# EAGLE design behavior_interface (EAGLE 9.6.2)
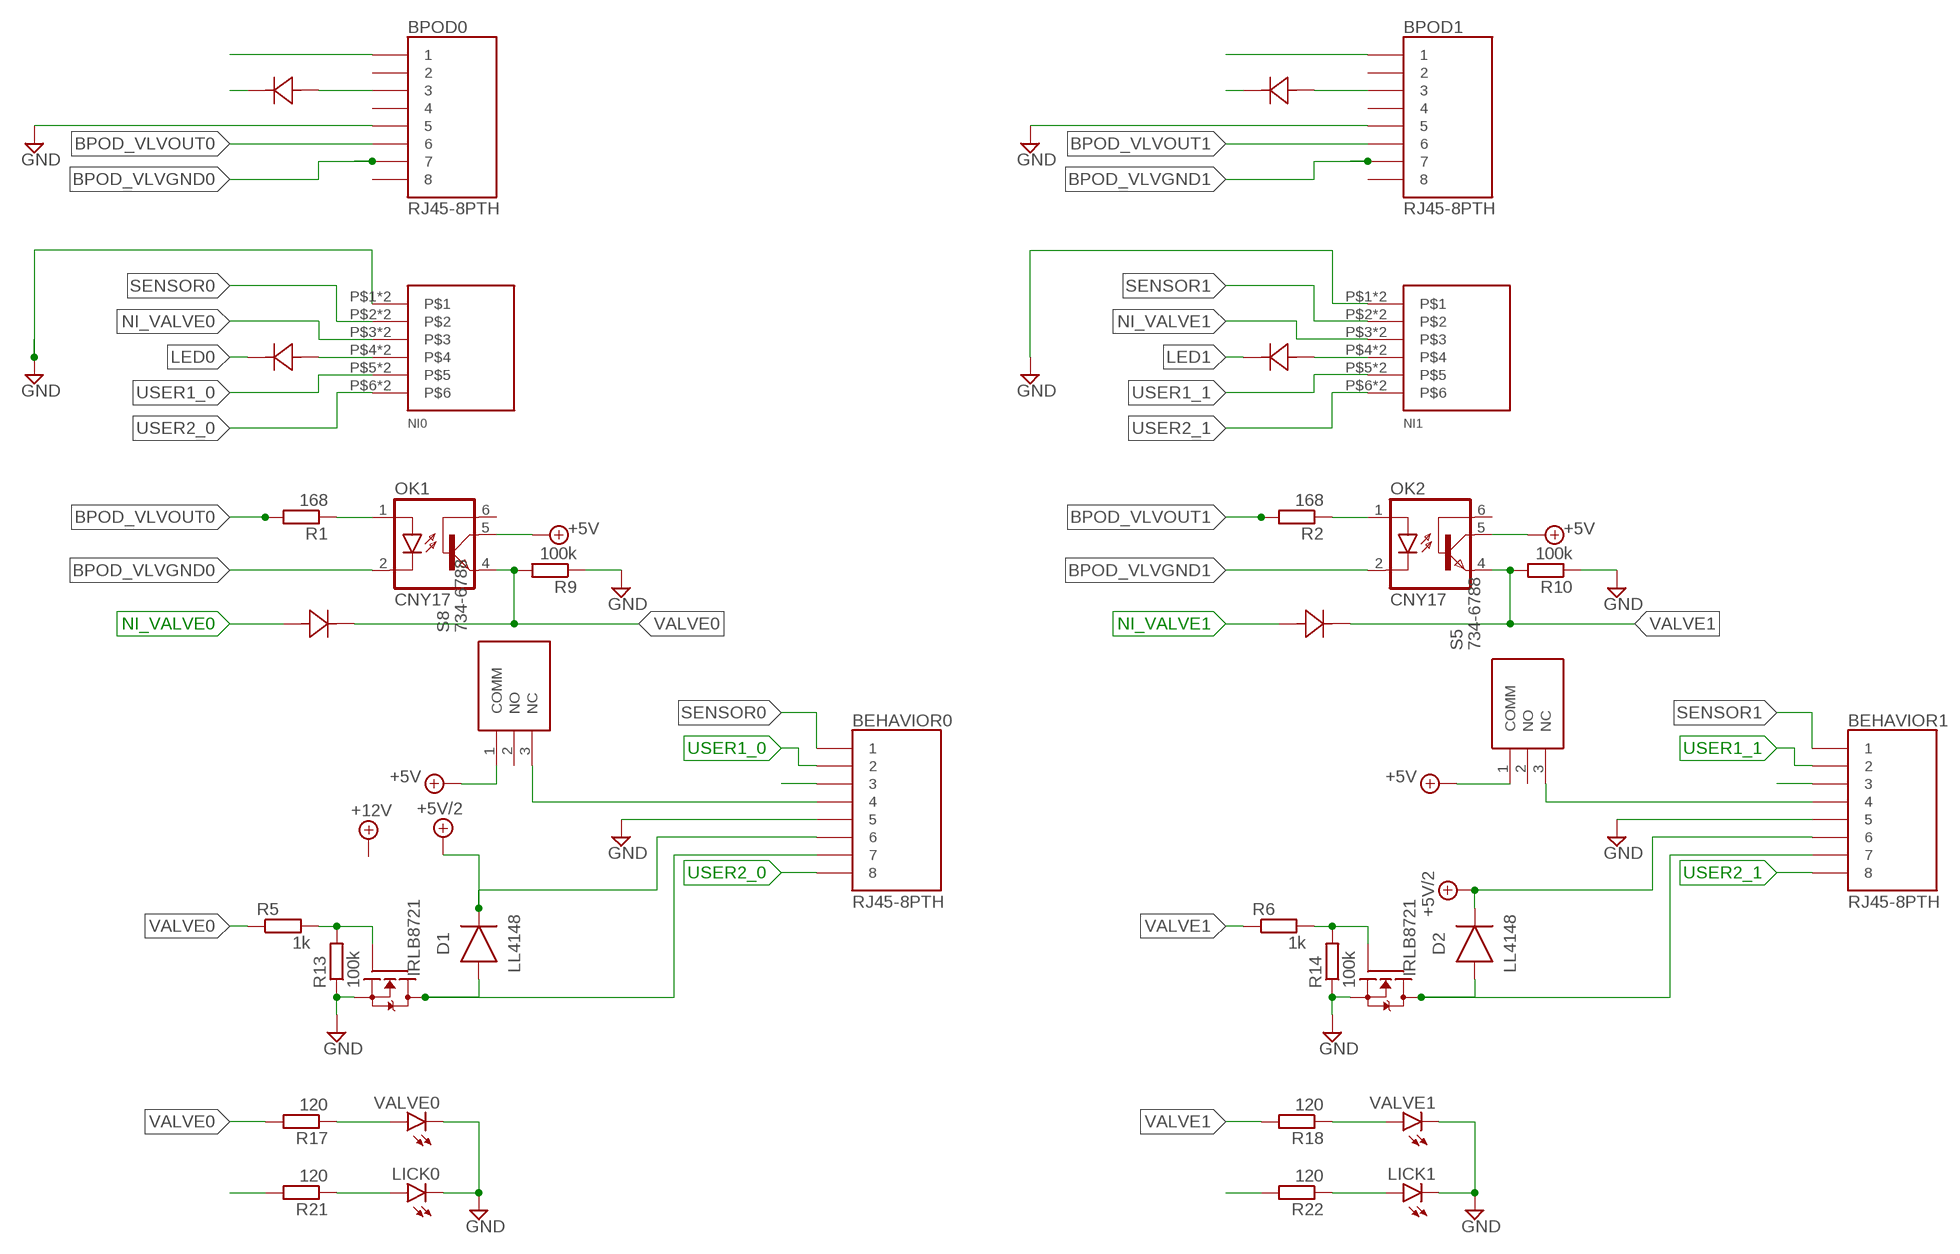
[diagram p0: schematic, sheet 1, part 1 of 2]
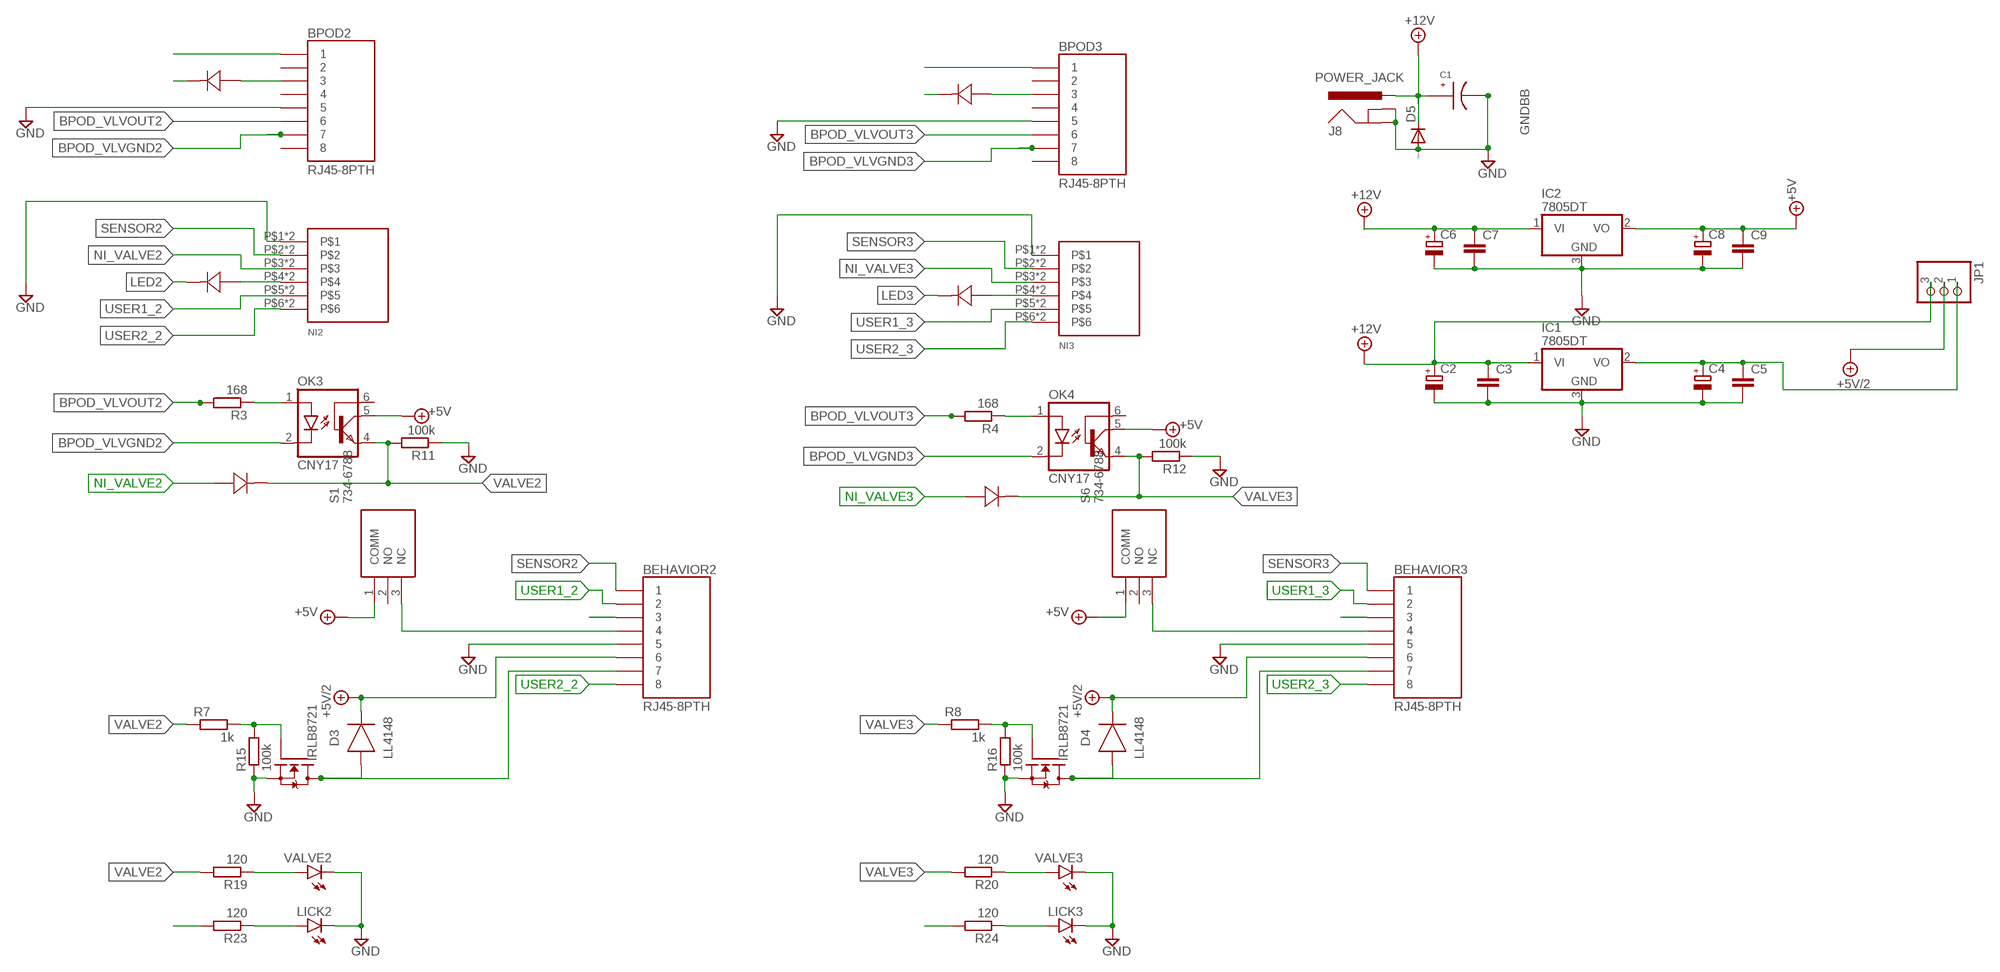
[diagram p1: schematic, sheet 1, part 2 of 2]

## Parts
BEHAVIOR0  RJ45-8PTH  [RJ45-8]
BEHAVIOR1  RJ45-8PTH  [RJ45-8]
BEHAVIOR2  RJ45-8PTH  [RJ45-8]
BEHAVIOR3  RJ45-8PTH  [RJ45-8]
BPOD0  RJ45-8PTH  [RJ45-8]
BPOD1  RJ45-8PTH  [RJ45-8]
BPOD2  RJ45-8PTH  [RJ45-8]
BPOD3  RJ45-8PTH  [RJ45-8]
C1  EEE-FK1H100UR  [EEE-FK1H100UR]
C2  CPOL-EUD  [PANASONIC_D]
C3  C-EUC1206  [C1206]
C4  CPOL-EUD  [PANASONIC_D]
C5  C-EUC1206  [C1206]
C6  CPOL-EUD  [PANASONIC_D]
C7  C-EUC1206  [C1206]
C8  CPOL-EUD  [PANASONIC_D]
C9  C-EUC1206  [C1206]
CR1  CUS10S30USC_TOS-M  [USC_TOS-M]
CR2  CUS10S30USC_TOS-M  [USC_TOS-M]
CR3  CUS10S30USC_TOS-M  [USC_TOS-M]
CR4  CUS10S30USC_TOS-M  [USC_TOS-M]
CR5  CUS10S30USC_TOS-M  [USC_TOS-M]
CR6  CUS10S30USC_TOS-M  [USC_TOS-M]
CR7  CUS10S30USC_TOS-M  [USC_TOS-M]
CR8  CUS10S30USC_TOS-M  [USC_TOS-M]
CR9  CUS10S30USC_TOS-M  [USC_TOS-M]
CR10  CUS10S30USC_TOS-M  [USC_TOS-M]
CR11  CUS10S30USC_TOS-M  [USC_TOS-M]
CR12  CUS10S30USC_TOS-M  [USC_TOS-M]
D1  LL4148  DIODE_LL4148_SOD-80  [DIOMELF3516]
D2  LL4148  DIODE_LL4148_SOD-80  [DIOMELF3516]
D3  LL4148  DIODE_LL4148_SOD-80  [DIOMELF3516]
D4  LL4148  DIODE_LL4148_SOD-80  [DIOMELF3516]
D5  DIODE-DO214AA  [DO214AA]
IC1  7805DT  [TO252]
IC2  7805DT  [TO252]
J8  POWER_JACK  [POWER_JACK_PTH]
JP1  PINHD-1X3  [1X03]
LICK0  LEDSIDELED  [OSRAM-SIDELED]
LICK1  LEDSIDELED  [OSRAM-SIDELED]
LICK2  LEDSIDELED  [OSRAM-SIDELED]
LICK3  LEDSIDELED  [OSRAM-SIDELED]
NI0  1-2834015-6  [1-2834015-6]
NI1  1-2834015-6  [1-2834015-6]
NI2  1-2834015-6  [1-2834015-6]
NI3  1-2834015-6  [1-2834015-6]
OK1  CNY17  [DIL06]
OK2  CNY17  [DIL06]
OK3  CNY17  [DIL06]
OK4  CNY17  [DIL06]
R1  168  R-EU_M1206  [M1206]
R2  168  R-EU_M1206  [M1206]
R3  168  R-EU_M1206  [M1206]
R4  168  R-EU_M1206  [M1206]
R5  1k  R-EU_M1206  [M1206]
R6  1k  R-EU_M1206  [M1206]
R7  1k  R-EU_M1206  [M1206]
R8  1k  R-EU_M1206  [M1206]
R9  100k  R-EU_M1206  [M1206]
R10  100k  R-EU_M1206  [M1206]
R11  100k  R-EU_M1206  [M1206]
R12  100k  R-EU_M1206  [M1206]
R13  100k  R-EU_M1206  [M1206]
R14  100k  R-EU_M1206  [M1206]
R15  100k  R-EU_M1206  [M1206]
R16  100k  R-EU_M1206  [M1206]
R17  120  R-EU_M1206  [M1206]
R18  120  R-EU_M1206  [M1206]
R19  120  R-EU_M1206  [M1206]
R20  120  R-EU_M1206  [M1206]
R21  120  R-EU_M1206  [M1206]
R22  120  R-EU_M1206  [M1206]
R23  120  R-EU_M1206  [M1206]
R24  120  R-EU_M1206  [M1206]
S1  734-6788  [7346788]
S5  734-6788  [7346788]
S6  734-6788  [7346788]
S8  734-6788  [7346788]
SETUP1  IRLB8721  [TO220V]
SETUP2  IRLB8721  [TO220V]
SETUP3  IRLB8721  [TO220V]
SETUP4  IRLB8721  [TO220V]
VALVE0  LEDSIDELED  [OSRAM-SIDELED]
VALVE1  LEDSIDELED  [OSRAM-SIDELED]
VALVE2  LEDSIDELED  [OSRAM-SIDELED]
VALVE3  LEDSIDELED  [OSRAM-SIDELED]

## Nets
+5V: C8.+ C9.1 IC2.2(VO) OK1.5(COL) OK2.5(COL) OK3.5(COL) OK4.5(COL) S1.1(COMM) S5.1(COMM) S6.1(COMM) S8.1(COMM)
+5V/2: BEHAVIOR0.6 BEHAVIOR1.6 BEHAVIOR2.6 BEHAVIOR3.6 D1.1(C) D2.1(C) D3.1(C) D4.1(C) JP1.2
+12V: C1.ANODE C2.+ C3.1 C6.+ C7.1 D5.C IC1.1(VI) IC2.1(VI) J8.PWR JP1.3
BPOD_VLVGND0: BPOD0.7 OK1.2(C)
BPOD_VLVGND1: BPOD1.7 OK2.2(C)
BPOD_VLVGND2: BPOD2.7 OK3.2(C)
BPOD_VLVGND3: BPOD3.7 OK4.2(C)
BPOD_VLVOUT0: BPOD0.6 R1.2
BPOD_VLVOUT1: BPOD1.6 R2.2
BPOD_VLVOUT2: BPOD2.6 R3.2
BPOD_VLVOUT3: BPOD3.6 R4.2
GND: BEHAVIOR0.5 BEHAVIOR1.5 BEHAVIOR2.5 BEHAVIOR3.5 BPOD0.5 BPOD1.5 BPOD2.5 BPOD3.5 C1.CATHODE C2.- C3.2 C4.- C5.2 C6.- C7.2 C8.- C9.2 D5.A IC1.3(GND) IC2.3(GND) J8.GND J8.GNDBREAK LICK0.C LICK1.C LICK2.C LICK3.C NI0.P$1 NI0.P$7 NI1.P$1 NI1.P$7 NI2.P$1 NI2.P$7 NI3.P$1 NI3.P$7 R9.1 R10.1 R11.1 R12.1 R13.1 R14.1 R15.1 R16.1 SETUP1.3(S) SETUP2.3(S) SETUP3.3(S) SETUP4.3(S) VALVE0.C VALVE1.C VALVE2.C VALVE3.C
LED0: BEHAVIOR0.3 CR1.1(CATHODE) CR5.1(CATHODE)
LED1: BEHAVIOR1.3 CR2.1(CATHODE) CR6.1(CATHODE)
LED2: BEHAVIOR2.3 CR3.1(CATHODE) CR7.1(CATHODE)
LED3: BEHAVIOR3.3 CR4.1(CATHODE) CR8.1(CATHODE)
N$1: R5.2 R13.2 SETUP1.1(G)
N$2: CR5.2(ANODE) NI0.P$4 NI0.P$10
N$3: CR8.2(ANODE) NI3.P$4 NI3.P$10
N$4: BEHAVIOR0.7 D1.2(A) SETUP1.2(D)
N$5: BEHAVIOR0.4 S8.3(NC)
N$6: OK1.1(A) R1.1
N$7: BPOD0.3 CR1.2(ANODE)
N$9: CR6.2(ANODE) NI1.P$4 NI1.P$10
N$10: LICK0.A R21.1
N$11: R17.1 VALVE0.A
N$12: R6.2 R14.2 SETUP2.1(G)
N$13: BEHAVIOR1.7 D2.2(A) SETUP2.2(D)
N$14: BEHAVIOR1.4 S5.3(NC)
N$15: OK2.1(A) R2.1
N$16: BPOD1.3 CR2.2(ANODE)
N$18: CR7.2(ANODE) NI2.P$4 NI2.P$10
N$19: LICK1.A R22.1
N$20: R18.1 VALVE1.A
N$21: R7.2 R15.2 SETUP3.1(G)
N$22: BEHAVIOR2.7 D3.2(A) SETUP3.2(D)
N$23: BEHAVIOR2.4 S1.3(NC)
N$24: OK3.1(A) R3.1
N$25: BPOD2.3 CR3.2(ANODE)
N$27: LICK2.A R23.1
N$28: R19.1 VALVE2.A
N$29: C4.+ C5.1 IC1.2(VO) JP1.1
N$30: R8.2 R16.2 SETUP4.1(G)
N$32: BEHAVIOR3.7 D4.2(A) SETUP4.2(D)
N$35: BEHAVIOR3.4 S6.3(NC)
N$36: OK4.1(A) R4.1
N$37: BPOD3.3 CR4.2(ANODE)
N$39: LICK3.A R24.1
N$40: R20.1 VALVE3.A
NI_VALVE0: CR9.2(ANODE) NI0.P$3 NI0.P$9
NI_VALVE1: CR10.2(ANODE) NI1.P$3 NI1.P$9
NI_VALVE2: CR11.2(ANODE) NI2.P$3 NI2.P$9
NI_VALVE3: CR12.2(ANODE) NI3.P$3 NI3.P$9
SENSOR0: BEHAVIOR0.1 BPOD0.1 NI0.P$2 NI0.P$8 R21.2
SENSOR1: BEHAVIOR1.1 BPOD1.1 NI1.P$2 NI1.P$8 R22.2
SENSOR2: BEHAVIOR2.1 BPOD2.1 NI2.P$2 NI2.P$8 R23.2
SENSOR3: BEHAVIOR3.1 BPOD3.1 NI3.P$2 NI3.P$8 R24.2
USER1_0: BEHAVIOR0.2 NI0.P$5 NI0.P$11
USER1_1: BEHAVIOR1.2 NI1.P$5 NI1.P$11
USER1_2: BEHAVIOR2.2 NI2.P$5 NI2.P$11
USER1_3: BEHAVIOR3.2 NI3.P$5 NI3.P$11
USER2_0: BEHAVIOR0.8 NI0.P$6 NI0.P$12
USER2_1: BEHAVIOR1.8 NI1.P$6 NI1.P$12
USER2_2: BEHAVIOR2.8 NI2.P$6 NI2.P$12
USER2_3: BEHAVIOR3.8 NI3.P$6 NI3.P$12
VALVE0: CR9.1(CATHODE) OK1.4(EMI) R5.1 R9.2 R17.2
VALVE1: CR10.1(CATHODE) OK2.4(EMI) R6.1 R10.2 R18.2
VALVE2: CR11.1(CATHODE) OK3.4(EMI) R7.1 R11.2 R19.2
VALVE3: CR12.1(CATHODE) OK4.4(EMI) R8.1 R12.2 R20.2
Unconnected: BPOD0.2 BPOD0.4 BPOD0.8 BPOD1.2 BPOD1.4 BPOD1.8 BPOD2.2 BPOD2.4 BPOD2.8 BPOD3.2 BPOD3.4 BPOD3.8 OK1.6(BAS) OK2.6(BAS) OK3.6(BAS) OK4.6(BAS) S1.2(NO) S5.2(NO) S6.2(NO) S8.2(NO)

## Notes on the sheet
- GNDBB

## Library data of the parts
BEHAVIOR0 BEHAVIOR1-BEHAVIOR3 BPOD0 BPOD1-BPOD3 = SparkFun:RJ45-8: RJ45 Jack Simple RJ45, 8-pin connection - connector for common Cat5, Cat5e, and Cat6 Ethernet cables. Footprint not yet proven in production. Connector sku is PRT-00643; Breakout PCB sku is BOB-00716.
C1 = JoshParts10:EEE-FK1H100UR
C2 C4 C6 C8 = rcl:CPOL-EU: POLARIZED CAPACITOR, European symbol; SPICEPREFIX: C
C3 C5 C7 C9 = rcl:C-EU: CAPACITOR, European symbol; SPICEPREFIX: C
CR1-CR12 = CUS10S30:CUS10S30; BUILT_BY: EMA_TJ; COPYRIGHT: Copyright (C) 2016 Accelerated Designs. All rights reserved; MANUFACTURER_PART_NUMBER: CUS10S30; SOURCELIBRARY: Toshiba_2018-09-20; VENDOR: Toshiba
D1-D4 = Diode:DIODE_: Diode Rectifier - Popular parts; CATEGORY: Diode; DESCRIPTION: DIODE GEN PURP 100V 200MA SOD80; MANUFACTURER: ON Semiconductor; SUB-CATEGORY: Rectifier
D5 = diode:DIODE-: DIODE
IC1 IC2 = adafruit:78*: Positive VOLTAGE REGULATOR Added bigger pads to the TO-92 package
J8 = SparkFun-Connectors:POWER_JACK: Power Jack Connector This is the standard 5.5mm barrel jack for power. The PTH is the most common, proven, reliable, footprint. The Slot footprint only works if the mill layer is transmitted to the PCB fab house so be warned. Here are the connectors we sell at SparkFun: DC Barrel Power Jack/Connector <https://www.sparkfun.com/products/119> (PRT-00119) DC Barrel Power Jack/Connector (SMD) <https://www.sparkfun.com/products/12748> (PRT-12748) DC Barrel Jack Adapter - Breadboard Compatible <https://www.sparkfun.com/products/10811> (PRT-10811) It is used on this SparkFun product (and many, many others): SparkFun RedBoard - Programmed with Arduino <https://www.sparkfun.com/products/12757> (DEV-12757) Also, if you need a mating power supply or connector, please check these out: Wall Adapter Power Supply - 9VDC 650mA <https://www.sparkfun.com/products/298> (TOL-00298) DC Barrel Jack Adapter - Male <https://www.sparkfun.com/products/10287> (PRT-10287); PROD_ID: CONN-08197
JP1 = pinhead:PINHD-1X3: PIN HEADER
LICK0 LICK1-LICK3 VALVE0 VALVE1-VALVE3 = led:LED: LED OSRAM: - CHIPLED LG R971, LG N971, LY N971, LG Q971, LY Q971, LO R971, LY R971 LH N974, LH R974 LS Q976, LO Q976, LY Q976 LO Q996 - Hyper CHIPLED LW Q18S LB Q993, LB Q99A, LB R99A - SideLED LS A670, LO A670, LY A670, LG A670, LP A670 LB A673, LV A673, LT A673, LW A673 LH A674 LY A675 LS A676, LA A676, LO A676, LY A676, LW A676 LS A679, LY A679, LG A679 - Hyper Micro SIDELED® LS Y876, LA Y876, LO Y876, LY Y876 LT Y87S - SmartLED LW L88C, LW L88S LB L89C, LB L89S, LG L890 LS L89K, LO L89K, LY L89K LS L896, LA L896, LO L896, LY L896 - TOPLED LS T670, LO T670, LY T670, LG T670, LP T670 LSG T670, LSP T670, LSY T670, LOP T670, LYG T670 LG T671, LOG T671, LSG T671 LB T673, LV T673, LT T673, LW T673 LH T674 LS T676, LA T676, LO T676, LY T676, LB T676, LH T676, LSB T676, LW T676 LB T67C, LV T67C, LT T67C, LS T67K, LO T67K, LY T67K, LW E67C LS E67B, LA E67B, LO E67B, LY E67B, LB E67C, LV E67C, LT E67C LW T67C LS T679, LY T679, LG T679 LS T770, LO T770, LY T770, LG T770, LP T770 LB T773, LV T773, LT T773, LW T773 LH T774 LS E675, LA E675, LY E675, LS T675 LS T776, LA T776, LO T776, LY T776, LB T776 LHGB T686 LT T68C, LB T68C - Hyper Mini TOPLED® LB M676 - Mini TOPLED Santana® LG M470 LS M47K, LO M47K, LY M47K Source: http://www.osram.convergy.de LUXEON: - LUMILED® LXK2-PW12-R00, LXK2-PW12-S00, LXK2-PW14-U00, LXK2-PW14-V00 LXK2-PM12-R00, LXK2-PM12-S00, LXK2-PM14-U00 LXK2-PE12-Q00, LXK2-PE12-R00, LXK2-PE12-S00, LXK2-PE14-T00, LXK2-PE14-U00 LXK2-PB12-K00, LXK2-PB12-L00, LXK2-PB12-M00, LXK2-PB14-N00, LXK2-PB14-P00, LXK2-PB14-Q00 LXK2-PR12-L00, LXK2-PR12-M00, LXK2-PR14-Q00, LXK2-PR14-R00 LXK2-PD12-Q00, LXK2-PD12-R00, LXK2-PD12-S00 LXK2-PH12-R00, LXK2-PH12-S00 LXK2-PL12-P00, LXK2-PL12-Q00, LXK2-PL12-R00 Source: www.luxeon.com KINGBRIGHT: KA-3528ASYC Source: www.kingbright.com
NI0 NI1-NI3 = 1-2834015-6:1-2834015-6
OK1-OK4 = optocoupler:CNY17: SIEMENS OPTO COUPLER; MPN: CNY17-1; OC_FARNELL: 1045399; OC_NEWARK: 05M4044
R1-R24 = rcl:R-EU_: RESISTOR, European symbol; SPICEPREFIX: R
S1 S5 S6 S8 = 734-6788:734-6788: SPDT PCB ON-(ON) Push Button Switch Source: Datasheet <https://docs-emea.rs-online.com/webdocs/1587/0900766b81587592.pdf>; DESCRIPTION: SPDT PCB ON-(ON) Push Button Switch; HEIGHT: 23.34mm; MANUFACTURER_NAME: RS Components; MANUFACTURER_PART_NUMBER: 734-6788
SETUP1-SETUP4 = IRLB8721:IRLB8721: VDSS RDS(on) max Qg (typ.) 30V 8.7m@VGS = 10V 7.6n Applications Benefits Very Low RDS(on) at 4.5V VGS Ultra-Low Gate Impedance Fully Characterized Avalanche Voltage and Current Lead-Free Optimized for UPS/Inverter Applications High Frequency Synchronous Buck Converters for Computer Processor Power High Frequency Isolated DC-DC Converters with Synchronous Rectification for Telecom and Industrial Use

## Net classes
0 default: width 0.254 mm, clearance 0.254 mm

## Board
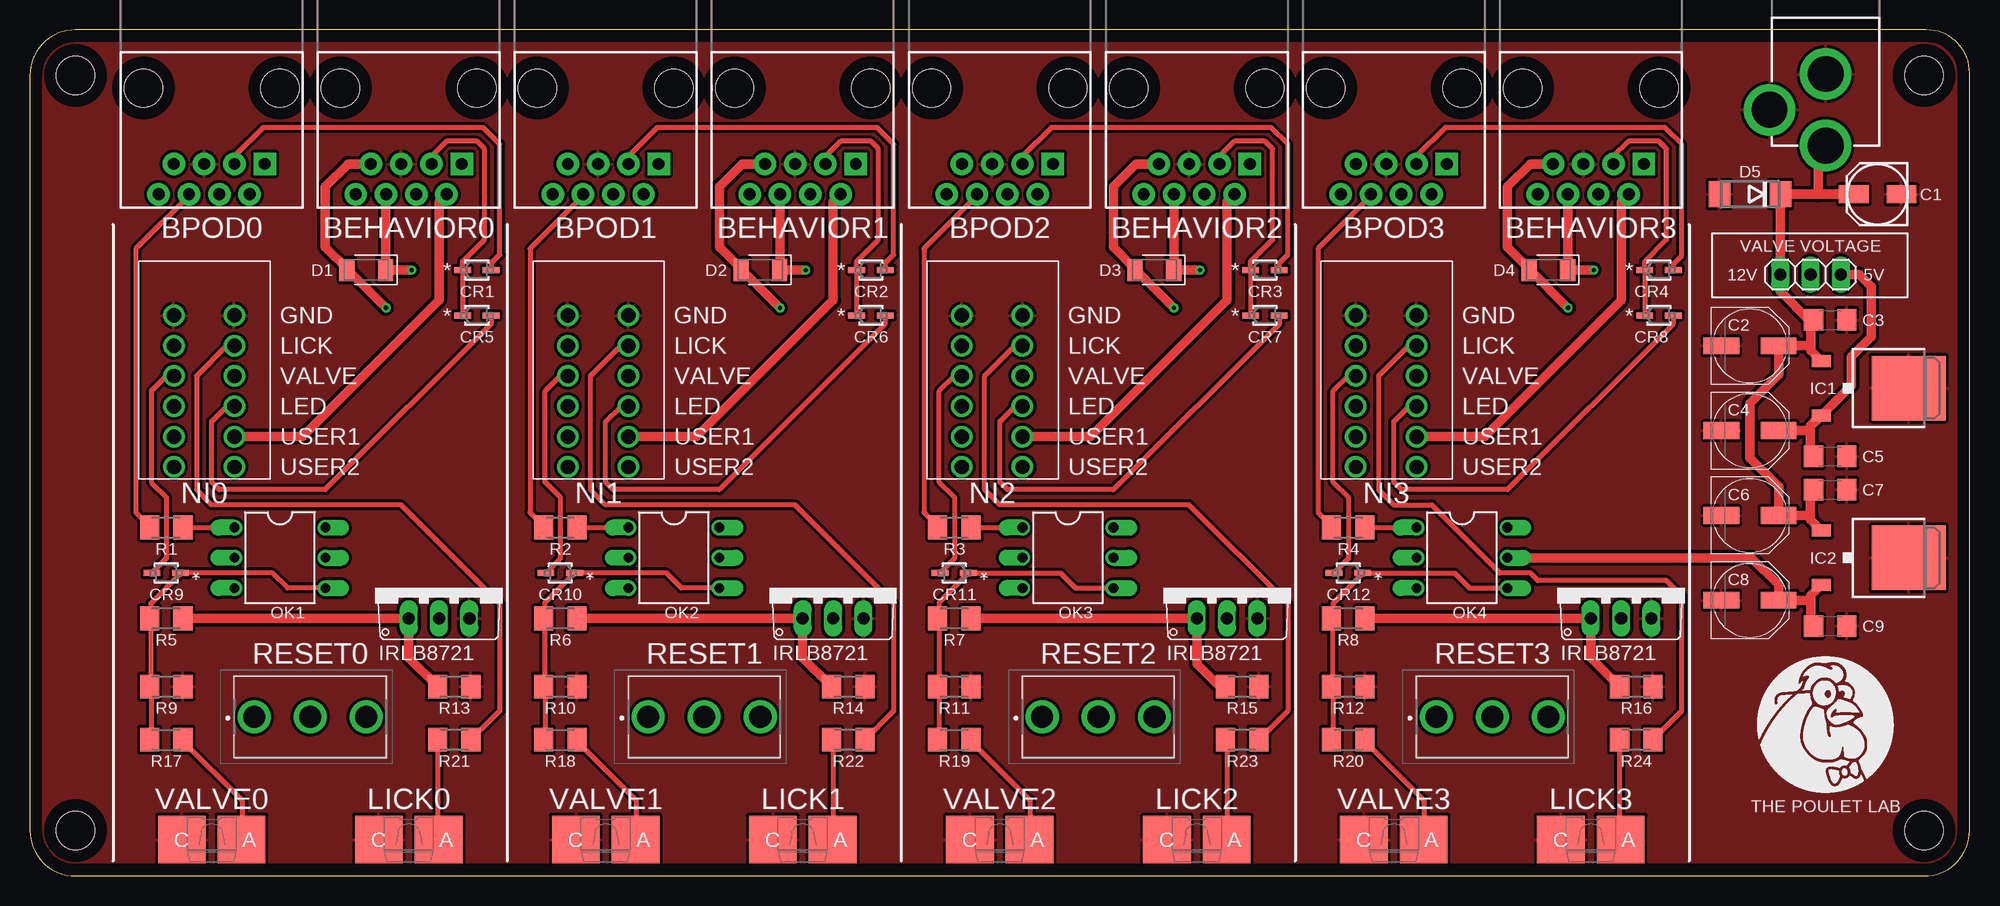
[diagram p2: board, top side]
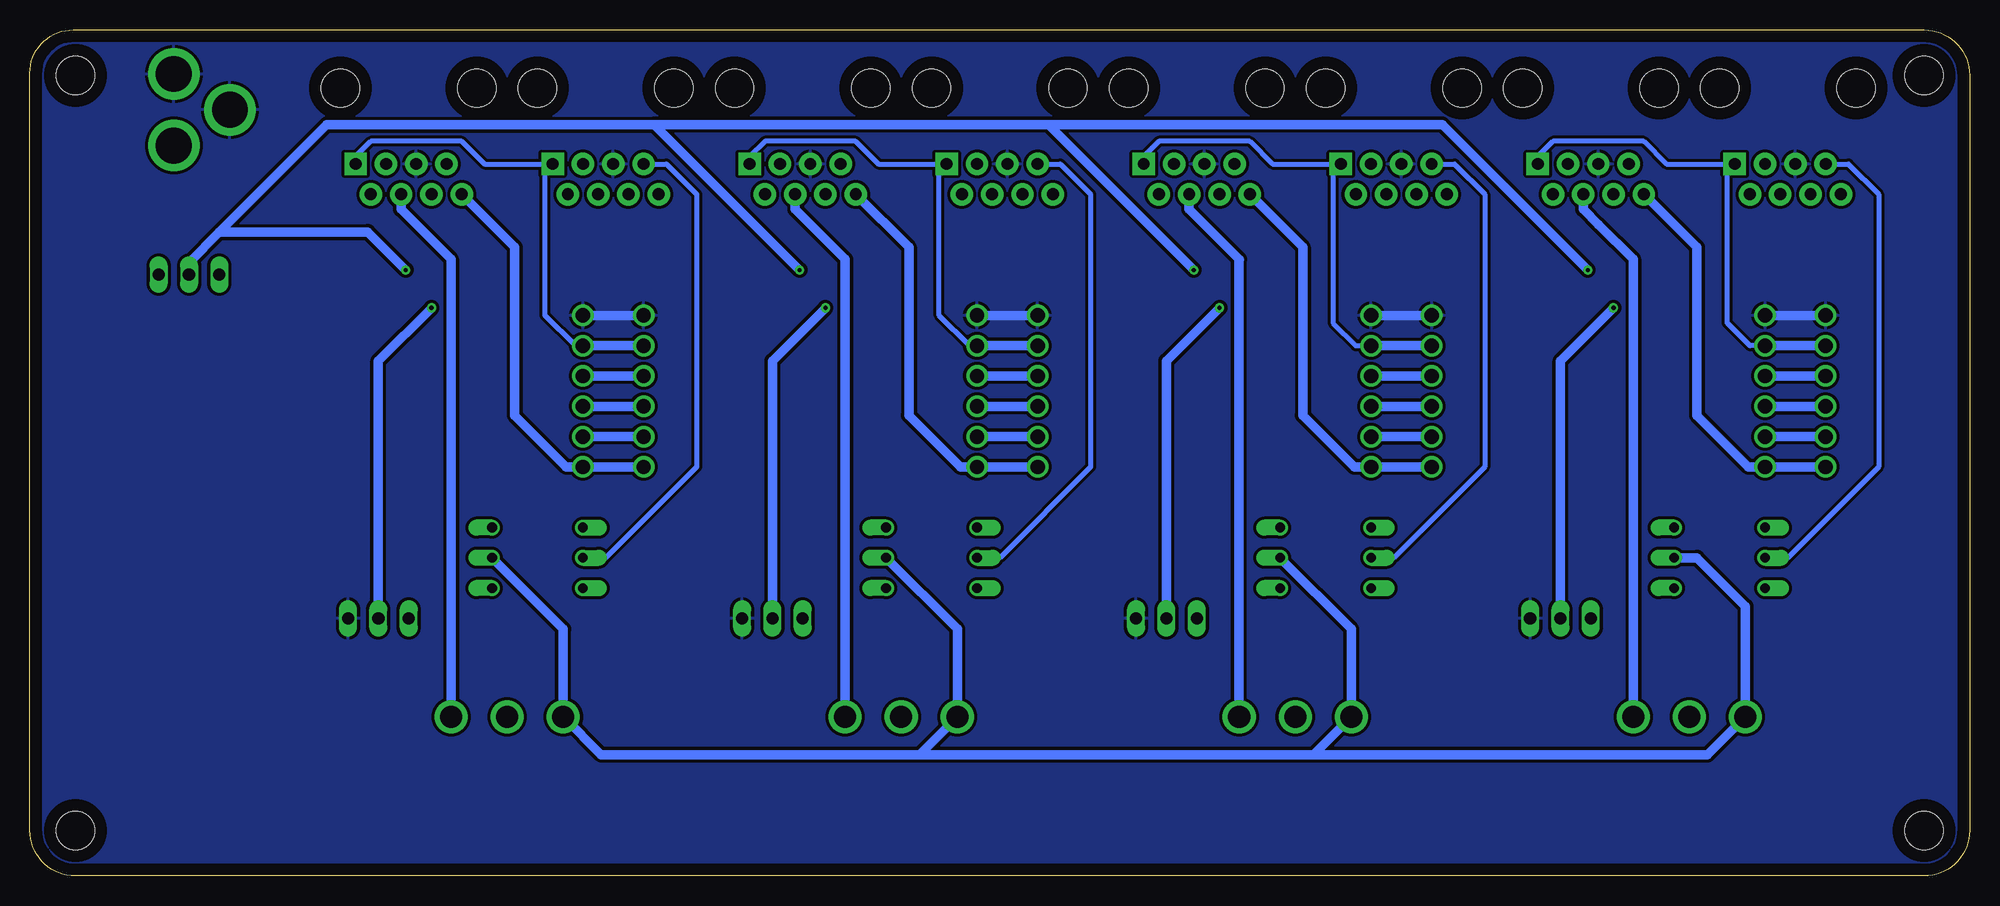
[diagram p3: board, bottom side, seen from below]

Size 162.56 x 70.93 mm. Coordinates in mm from the lower left corner, seen from the top.
Outline: 162.56,3.81 162.56,67.31 arc90 158.94,70.93 3.81,70.93 arc90 0,67.12 0,3.81 arc90 3.81,0 158.75,0 arc90 162.56,3.81
Copper layers (1*16): Top 0.035mm / dielectric 1.5mm / Bottom 0.035mm
Design rules "default": minimum track width 6mil, minimum drill 0.35mm, track to track 6mil, track to pad 6mil, pad to pad 6mil, via to via 6mil, smd to smd 6mil, copper to edge 40mil, drill to drill 6mil, minimum pad ring 10mil, minimum via ring 8mil, stop-mask expansion 4mil, vias tented up to drill 0mil, thermal gap 10mil
Holes 3.2 mm at 3.81,67.12 3.81,3.81 158.75,67.12 158.75,3.81

### Footprints (pad centres in the part's own frame; a part is rotated, then mirrored left to right if it is on the bottom)
RJ45-8 = drill 1 pad 1.88 square: 1 -4.445,6.35 | drill 1 pad 1.88: 2 -3.175,8.89; 3 -1.905,6.35; 4 -0.635,8.89; 5 0.635,6.35; 6 1.905,8.89; 7 3.175,6.35; 8 4.445,8.89 | hole 3.2: -5.715,0; 5.715,0
EEE-FK1H100UR = smd 1.5 x 2.5: ANODE 0,4; CATHODE 0,0
PANASONIC_D = smd 3 x 1.4: + 2.4,0; - -2.4,0
C1206 = smd 1.6 x 1.8: 1 -1.4,0; 2 1.4,0
USC_TOS-M = smd 1.4 x 0.5: 1 -1.2,0; 2 1.2,0
DIOMELF3516 = smd 1.275 x 1.85: 1 -1.62,0; 2 1.62,0
DO214AA = smd 1.8 x 2.2: A 2.55,0; C -2.55,0
TO252 = smd 1 x 1.6: 1 -2.28,-4.8; 2 2.28,-4.8 | smd 5.4 x 6.2: 3 0,2.5
POWER_JACK_PTH = drill 2.997 pad 4.318: GND 0,7.7; GNDBREAK 4.7,10.7; PWR 0,13.7
1X03 = drill 1.016 long: 1 -2.54,0; 2 0,0; 3 2.54,0
OSRAM-SIDELED = smd 4 x 4: A 0,2.5; C 0,-2.5
1-2834015-6 = drill 1.2: P$1 0,0; P$2 2.54,0; P$3 5.08,0; P$4 7.62,0; P$5 10.16,0; P$6 12.7,0; P$7 0,-5.08; P$8 2.54,-5.08; P$9 5.08,-5.08; P$10 7.62,-5.08; P$11 10.16,-5.08; P$12 12.7,-5.08
DIL06 = drill 0.813 offset: 1 -2.54,-3.81; 2 0,-3.81; 3 2.54,-3.81; 4 2.54,3.81; 5 0,3.81; 6 -2.54,3.81
M1206 = smd 1.6 x 2: 1 -1.4,0; 2 1.4,0
7346788 = drill 1.85 pad 2.775: 1 0,0; 2 0,-4.7; 3 0,-9.4
TO220V = drill 1.016 long: 1 -2.54,-2.54; 2 0,-2.54; 3 2.54,-2.54

### Placement (x,y rotation side)
BEHAVIOR0  31.75,66.04 180 top
BEHAVIOR1  64.77,66.04 180 top
BEHAVIOR2  97.79,66.04 180 top
BEHAVIOR3  130.81,66.04 180 top
BPOD0  15.24,66.04 180 top
BPOD1  48.26,66.04 180 top
BPOD2  81.28,66.04 180 top
BPOD3  114.3,66.04 180 top
C1  156.84,57.15 90 top
C2  144.15,44.45 0 top
C3  150.88,46.61 0 top
C4  144.15,37.34 0 top
C5  150.88,35.18 0 top
C6  144.15,30.23 0 top
C7  150.88,32.38 0 top
C8  144.15,23.11 0 top
C9  150.88,20.95 0 top
CR1  37.47,50.8 0 top
CR2  70.48,50.8 0 top
CR3  103.5,50.8 0 top
CR4  136.53,50.8 0 top
CR5  37.47,46.99 0 top
CR6  70.48,46.99 0 top
CR7  103.5,46.99 0 top
CR8  136.53,46.99 0 top
CR9  11.43,25.4 180 top
CR10  44.45,25.4 180 top
CR11  77.47,25.4 180 top
CR12  110.49,25.4 180 top
D1  28.19,50.8 180 top
D2  61.21,50.8 180 top
D3  94.23,50.8 180 top
D4  127.25,50.8 180 top
D5  144.15,57.15 180 top
IC1  154.94,40.89 270 top
IC2  154.94,26.67 270 top
J8  150.5,74.93 180 top
JP1  149.22,50.42 180 top
LICK0  31.75,3.05 270 top
LICK1  64.77,3.05 270 top
LICK2  97.79,3.05 270 top
LICK3  130.81,3.05 270 top
NI0  17.14,46.99 270 top
NI1  50.16,46.99 270 top
NI2  83.19,46.99 270 top
NI3  116.2,46.99 270 top
OK1  20.95,26.67 270 top
OK2  53.98,26.67 270 top
OK3  87,26.67 270 top
OK4  120.02,26.67 270 top
R1  11.43,29.21 180 top
R2  44.45,29.21 180 top
R3  77.47,29.21 180 top
R4  110.49,29.21 180 top
R5  11.43,21.59 0 top
R6  44.45,21.59 0 top
R7  77.47,21.59 0 top
R8  110.49,21.59 0 top
R9  11.43,15.88 180 top
R10  44.45,15.88 180 top
R11  77.47,15.88 180 top
R12  110.49,15.88 180 top
R13  35.56,15.88 180 top
R14  68.58,15.88 180 top
R15  101.6,15.88 180 top
R16  134.62,15.88 180 top
R17  11.43,11.43 180 top
R18  44.45,11.43 180 top
R19  77.47,11.43 180 top
R20  110.49,11.43 180 top
R21  35.56,11.43 0 top
R22  68.58,11.43 0 top
R23  101.6,11.43 0 top
R24  134.62,11.43 0 top
S1  84.84,13.34 90 top
S5  51.82,13.34 90 top
S6  117.86,13.34 90 top
S8  18.8,13.34 90 top
SETUP1  34.29,24.13 0 top
SETUP2  67.31,24.13 0 top
SETUP3  100.33,24.13 0 top
SETUP4  133.35,24.13 0 top
VALVE0  15.24,3.05 270 top
VALVE1  48.26,3.05 270 top
VALVE2  81.28,3.05 270 top
VALVE3  114.3,3.05 270 top

### Tracks (layer width: path | path; a pad name or v marks a point on that pad's centre or on a via)
+5V
  Top 0.813: 149.25,23.11 149.25,23.5 IC2.2 | 149.25,23.11 149.25,21.18 C9.1 | 149.25,23.11 C8.+ 146.54,24.38 144.26,26.67 OK4.5
  Bottom 0.813: OK1.5 22.86,26.67 18.8,22.61 S8.1 21.96,10.17 54.98,10.17 | 54.98,10.17 S5.1 51.82,20.7 OK2.5 | 54.98,10.17 88,10.17 | 88,10.17 S1.1 84.84,20.7 OK3.5 | OK4.5 117.86,20.7 S6.1 117.84,13.34 114.67,10.17 88,10.17
+5V/2  (via drill 0.35)
  Top 0.813: BEHAVIOR0.6 29.81,57.12 D1.1 v32,50.8 | 62.87,50.83 D2.1 | BEHAVIOR1.6 62.87,50.83 | v65.02,50.8 62.9,50.8 62.87,50.83 | v98.04,50.8 D3.1 95.89,50.83 BEHAVIOR2.6 | v131.06,50.8 D4.1 128.87,57.12 BEHAVIOR3.6
  Bottom 0.813: v32,50.8 44.2,62.99 77.22,62.99 | v65.02,50.8 77.22,62.99 | v98.04,50.8 110.24,62.99 | 77.22,62.99 110.24,62.99 | 146.69,53.98 149.22,51.44 JP1.2 | 146.69,53.98 137.67,62.99 110.24,62.99 | v131.06,50.8 134.24,53.98 146.69,53.98
+12V
  Top 0.813: 149.86,57.15 D5.C JP1.3 146.69,49.02 149.09,46.61 C3.1 149.25,46.61 149.25,44.45 | C1.ANODE 149.86,57.15 | 149.25,44.45 149.25,44.06 IC1.1 | 149.25,44.45 C2.+ 146.54,42.02 144.15,39.62 144.15,35.04 146.54,32.64 C6.+ 149.22,30.23 | IC2.1 149.22,29.86 149.22,30.23 | 149.22,30.23 149.22,31.75 149.48,32 C7.1 | J8.PWR 149.86,60.59 149.86,57.15
BPOD_VLVGND0
  Bottom 0.406: BPOD0.7 10.16,59.69 7.62,57.15 7.62,34.29 15.24,26.67 OK1.2
BPOD_VLVGND1
  Bottom 0.406: BPOD1.7 43.18,59.69 40.64,57.15 40.64,34.29 48.26,26.67 OK2.2
BPOD_VLVGND2
  Bottom 0.406: BPOD2.7 76.2,59.69 73.66,57.15 73.66,34.29 81.28,26.67 OK3.2
BPOD_VLVGND3
  Bottom 0.406: BPOD3.7 109.22,59.69 106.68,57.15 106.68,34.29 114.3,26.67 OK4.2
BPOD_VLVOUT0
  Top 0.406: R1.2 10.03,29.34 8.89,30.48 8.89,52.58 13.34,57.02 BPOD0.6
BPOD_VLVOUT1
  Top 0.406: R2.2 43.05,29.34 41.91,30.48 41.91,52.58 46.35,57.02 BPOD1.6
BPOD_VLVOUT2
  Top 0.406: R3.2 76.07,29.34 74.93,30.48 74.93,52.58 79.38,57.02 BPOD2.6
BPOD_VLVOUT3
  Top 0.406: R4.2 109.09,29.34 107.95,30.48 107.95,52.58 112.39,57.02 BPOD3.6
GND
  Bottom 0.813: NI0.P$7 NI0.P$1 | NI1.P$7 NI1.P$1 | NI2.P$7 NI2.P$1 | NI3.P$7 NI3.P$1
  pour Top: 0,0 0,71.12 162.56,71.12 162.56,0
  pour Bottom: 0,0 0,71.12 162.56,71.12 162.56,0
LED0
  Top 0.406: BEHAVIOR0.3 33.66,60.33 34.92,61.59 37.47,61.59 38.1,60.96 38.1,53.34 36.27,51.51 CR1.1 CR5.1
LED1
  Top 0.406: BEHAVIOR1.3 66.67,60.33 67.94,61.59 70.48,61.59 71.12,60.96 71.12,53.34 69.28,51.51 CR2.1 CR6.1
LED2
  Top 0.406: BEHAVIOR2.3 99.69,60.33 100.97,61.59 103.5,61.59 104.14,60.96 104.14,53.34 102.31,51.51 CR3.1 CR7.1
LED3
  Top 0.406: BEHAVIOR3.3 132.72,60.33 133.99,61.59 136.53,61.59 137.16,60.96 137.16,53.34 135.32,51.51 CR4.1 CR8.1
N$1
  Top 0.813: R5.2 SETUP1.1 31.75,18.29 R13.2
N$2
  Top 0.406: CR5.2 38.66,46.28 24.77,32.38 15.88,32.38 15.24,33.02 15.24,38.1 16.51,39.37 NI0.P$4
  Bottom 0.813: NI0.P$4 NI0.P$10
N$3
  Top 0.406: CR8.2 137.72,46.28 123.83,32.38 114.94,32.38 114.3,33.02 114.3,38.1 115.57,39.37 NI3.P$4
  Bottom 0.813: NI3.P$4 NI3.P$10
N$4  (via drill 0.35)
  Top 0.813: BEHAVIOR0.7 26.67,59.69 24.77,57.78 24.77,52.74 26.64,50.86 26.62,50.85 | v29.84,47.62 26.62,50.85 | D1.2 26.62,50.85
  Bottom 0.813: SETUP1.2 34.29,43.18 v29.84,47.62
N$5
  Bottom 0.813: BEHAVIOR0.4 32.38,55.88 31.12,54.61 28.2,51.72 S8.3
N$6
  Top 0.406: R1.1 OK1.1
N$7
  Top 0.406: CR1.2 38.66,51.37 39.37,52.07 39.37,61.34 37.97,62.74 19.56,62.74 17.14,60.33 BPOD0.3
N$9
  Top 0.406: CR6.2 71.69,46.28 57.78,32.38 48.9,32.38 48.26,33.02 48.26,38.1 49.53,39.37 NI1.P$4
  Bottom 0.813: NI1.P$10 NI1.P$4
N$10
  Top 0.406: LICK0.A 34.16,3.05 R21.1
N$11
  Top 0.406: R17.1 12.83,11.3 17.78,6.35 17.78,3.09 VALVE0.A
N$12
  Top 0.813: R14.2 64.77,18.29 SETUP2.1 R6.2
N$13  (via drill 0.35)
  Top 0.813: BEHAVIOR1.7 59.69,59.69 57.78,57.78 57.78,52.7 59.59,50.9 D2.2 59.69,50.8 v62.87,47.62
  Bottom 0.813: v62.87,47.62 67.31,43.18 SETUP2.2
N$14
  Bottom 0.813: BEHAVIOR1.4 65.41,55.88 61.21,51.69 61.22,51.69 S5.3
N$15
  Top 0.406: R2.1 OK2.1
N$16
  Top 0.406: CR2.2 71.69,51.37 72.39,52.07 72.39,61.34 70.99,62.74 52.58,62.74 50.16,60.33 BPOD1.3
N$18
  Top 0.406: CR7.2 104.7,46.28 90.81,32.38 81.92,32.38 81.28,33.02 81.28,38.1 82.55,39.37 NI2.P$4
  Bottom 0.813: NI2.P$10 NI2.P$4
N$19
  Top 0.406: R22.1 67.31,11.3 67.31,3.05 LICK1.A
N$20
  Top 0.406: VALVE1.A 50.8,3.09 50.8,6.35 45.85,11.3 R18.1
N$21
  Top 0.813: R7.2 SETUP3.1 97.79,17.78 99.69,15.88 R15.2
N$22  (via drill 0.35)
  Top 0.813: BEHAVIOR2.7 92.71,59.69 90.81,57.78 90.81,52.7 92.71,50.8 | v95.89,47.62 92.71,50.8 | 92.71,50.8 D3.2
  Bottom 0.813: SETUP3.2 100.33,43.18 v95.89,47.62
N$23
  Bottom 0.813: BEHAVIOR2.4 98.42,55.88 94.24,51.69 S1.3
N$24
  Top 0.406: R3.1 OK3.1
N$25
  Top 0.406: CR3.2 104.7,51.37 105.41,52.07 105.41,61.34 104.01,62.74 85.6,62.74 83.19,60.33 BPOD2.3
N$27
  Top 0.406: R23.1 100.33,11.3 100.33,3.05 LICK2.A
N$28
  Top 0.406: VALVE2.A 83.82,3.05 83.82,6.35 78.87,11.3 R19.1
N$29
  Top 0.813: 149.22,37.47 149.22,37.7 IC1.2 152.65,41.13 152.65,43.56 154.31,45.21 154.31,49.4 153.29,50.42 JP1.1 | 149.22,37.47 149.22,35.43 C5.1 | C4.+ 149.1,37.34 149.22,37.47
N$30
  Top 0.813: R16.2 130.81,18.29 SETUP4.1 R8.2
N$32  (via drill 0.35)
  Top 0.813: BEHAVIOR3.7 125.73,59.69 123.83,57.78 123.83,52.7 125.63,50.9 | 125.63,50.9 D4.2 | v128.91,47.62 125.63,50.9
  Bottom 0.813: SETUP4.2 133.35,43.18 v128.91,47.62
N$35
  Bottom 0.813: BEHAVIOR3.4 131.44,55.88 127.25,51.69 S6.3
N$36
  Top 0.406: R4.1 OK4.1
N$37
  Top 0.406: CR4.2 137.72,51.31 138.43,52.01 138.43,61.34 137.03,62.74 118.62,62.74 116.2,60.33 BPOD3.3
N$39
  Top 0.406: R24.1 133.22,3.05 LICK3.A
N$40
  Top 0.406: VALVE3.A 116.84,3.09 116.84,6.31 116.8,6.35 116.8,6.39 111.89,11.3 R20.1
NI_VALVE0
  Top 0.406: NI0.P$9 11.43,41.91 10.19,40.66 10.19,32.99 11.43,31.75 11.43,26.6 CR9.2
  Bottom 0.813: NI0.P$9 NI0.P$3
NI_VALVE1
  Top 0.406: CR10.2 44.45,26.6 44.45,31.75 43.18,33.02 43.18,40.64 44.45,41.91 NI1.P$9
  Bottom 0.813: NI1.P$9 NI1.P$3
NI_VALVE2
  Top 0.406: CR11.2 77.47,26.6 77.47,31.75 76.2,33.02 76.2,40.64 77.47,41.91 NI2.P$9
  Bottom 0.813: NI2.P$9 NI2.P$3
NI_VALVE3
  Top 0.406: CR12.2 110.49,26.6 110.49,31.75 109.22,33.02 109.22,40.64 110.49,41.91 NI3.P$9
  Bottom 0.813: NI3.P$9 NI3.P$3
SENSOR0
  Top 0.406: R21.2 39.37,13.84 39.37,22.86 31.11,31.11 15.24,31.11 13.97,32.38 13.97,41.91 16.51,44.45 NI0.P$2
  Bottom 0.406: BEHAVIOR0.1 36.2,60.33 34.92,61.59 27.3,61.59 25.4,59.69 BPOD0.1 20.32,59.05 20.32,46.35 18.41,44.45 NI0.P$2
  Bottom 0.813: NI0.P$8 NI0.P$2
SENSOR1
  Top 0.406: R22.2 72.39,13.84 72.39,22.86 64.14,31.11 48.26,31.11 46.99,32.38 46.99,41.91 49.53,44.45 NI1.P$2
  Bottom 0.406: BEHAVIOR1.1 69.22,60.33 67.94,61.59 60.33,61.59 58.42,59.69 BPOD1.1 53.34,59.05 53.34,46.35 51.44,44.45 NI1.P$2
  Bottom 0.813: NI1.P$2 NI1.P$8
SENSOR2
  Top 0.406: R23.2 105.41,13.84 105.41,22.86 97.16,31.11 81.28,31.11 80.01,32.38 80.01,41.91 82.55,44.45 NI2.P$2
  Bottom 0.406: BEHAVIOR2.1 102.23,60.33 100.97,61.59 93.34,61.59 91.44,59.69 BPOD2.1 86.36,59.05 86.36,46.99 83.82,44.45 NI2.P$2
  Bottom 0.813: NI2.P$8 NI2.P$2
SENSOR3
  Top 0.406: R24.2 138.43,13.84 138.43,23.5 137.16,24.77 126.36,24.77 125.73,25.4 123.19,25.4 117.47,31.11 114.3,31.11 113.03,32.38 113.03,41.91 115.57,44.45 NI3.P$2
  Bottom 0.406: BEHAVIOR3.1 135.25,60.33 133.99,61.59 126.36,61.59 124.46,59.69 BPOD3.1 119.38,59.05 119.38,46.99 116.84,44.45 NI3.P$2
  Bottom 0.813: NI3.P$2 NI3.P$8
USER1_0
  Top 0.813: BEHAVIOR0.2 34.29,56.52 34.29,48.26 22.86,36.83 NI0.P$5
  Bottom 0.813: NI0.P$11 NI0.P$5
USER1_1
  Top 0.813: BEHAVIOR1.2 67.31,56.52 67.31,48.26 55.88,36.83 NI1.P$5
  Bottom 0.813: NI1.P$5 NI1.P$11
USER1_2
  Top 0.813: BEHAVIOR2.2 100.33,56.52 100.33,48.26 88.9,36.83 NI2.P$5
  Bottom 0.813: NI2.P$11 NI2.P$5
USER1_3
  Top 0.813: BEHAVIOR3.2 133.35,56.52 133.35,48.26 121.92,36.83 NI3.P$5
  Bottom 0.813: NI3.P$11 NI3.P$5
USER2_0
  Bottom 0.813: NI0.P$12 NI0.P$6 18.54,34.29 22.86,38.61 22.86,52.7 BEHAVIOR0.8
USER2_1
  Bottom 0.813: BEHAVIOR1.8 55.88,52.7 55.88,38.61 51.56,34.29 NI1.P$6 NI1.P$12
USER2_2
  Bottom 0.813: NI2.P$12 NI2.P$6 84.58,34.29 88.9,38.61 88.9,52.7 BEHAVIOR2.8
USER2_3
  Bottom 0.813: NI3.P$12 NI3.P$6 117.6,34.29 121.92,38.61 121.92,52.7 BEHAVIOR3.8
VALVE0
  Top 0.254: R5.1 10.16,21.72
  Top 0.406: OK1.4 21.59,24.13 20.32,25.4 12.7,25.4 | 10.16,15.74 10.16,21.72 10.16,22.86 12.7,25.4 | R9.2 10.16,15.74 | R17.2 10.16,11.56 10.16,15.74 | 12.7,25.4 CR9.1
VALVE1
  Top 0.254: R10.2 43.18,15.88 | R6.1 43.18,21.72
  Top 0.406: R10.2 43.18,15.75 43.18,11.56 R18.2 | 43.18,15.88 43.18,21.72 43.18,22.93 CR10.1 53.34,25.4 54.61,24.13 OK2.4
VALVE2
  Top 0.254: R7.1 76.2,21.72
  Top 0.406: R19.2 76.2,11.56 76.2,15.75 R11.2 76.2,16 76.2,21.46 R7.1 | OK3.4 87.63,24.13 86.36,25.4 CR11.1 76.2,22.93 76.2,21.72
VALVE3
  Top 0.254: R12.2 109.22,15.85 | R8.1 109.22,21.72
  Top 0.406: R12.2 109.22,15.75 109.22,11.56 R20.2 | 109.22,15.85 109.22,21.72 109.22,22.86 111.69,25.33 CR12.1 119.38,25.4 120.65,24.13 OK4.4

### Text on the board
tPlace: VALVE VOLTAGE | 12V | 5V | THE POULET LAB
tNames: BPOD0 | BEHAVIOR0 | BPOD1 | BEHAVIOR1 | BPOD2 | BEHAVIOR2 | BPOD3 | BEHAVIOR3 | GND | GND | GND | GND | LICK | LICK | LICK | LICK | VALVE | VALVE | VALVE | VALVE | LED | LED | LED | LED | USER1 | USER1 | USER1 | USER1 | USER2 | USER2 | USER2 | USER2 | RESET0 | RESET1 | RESET2 | RESET3